# Altium schematic sheet 950V_Measure.SchDoc
size A2; Date: Date; CompanyName: HESSO; Engineer: Name; Address1: Route du Rawyl 47; Address2: 1950 Sion; Address3: Switzerland; ProjectName: Project Name
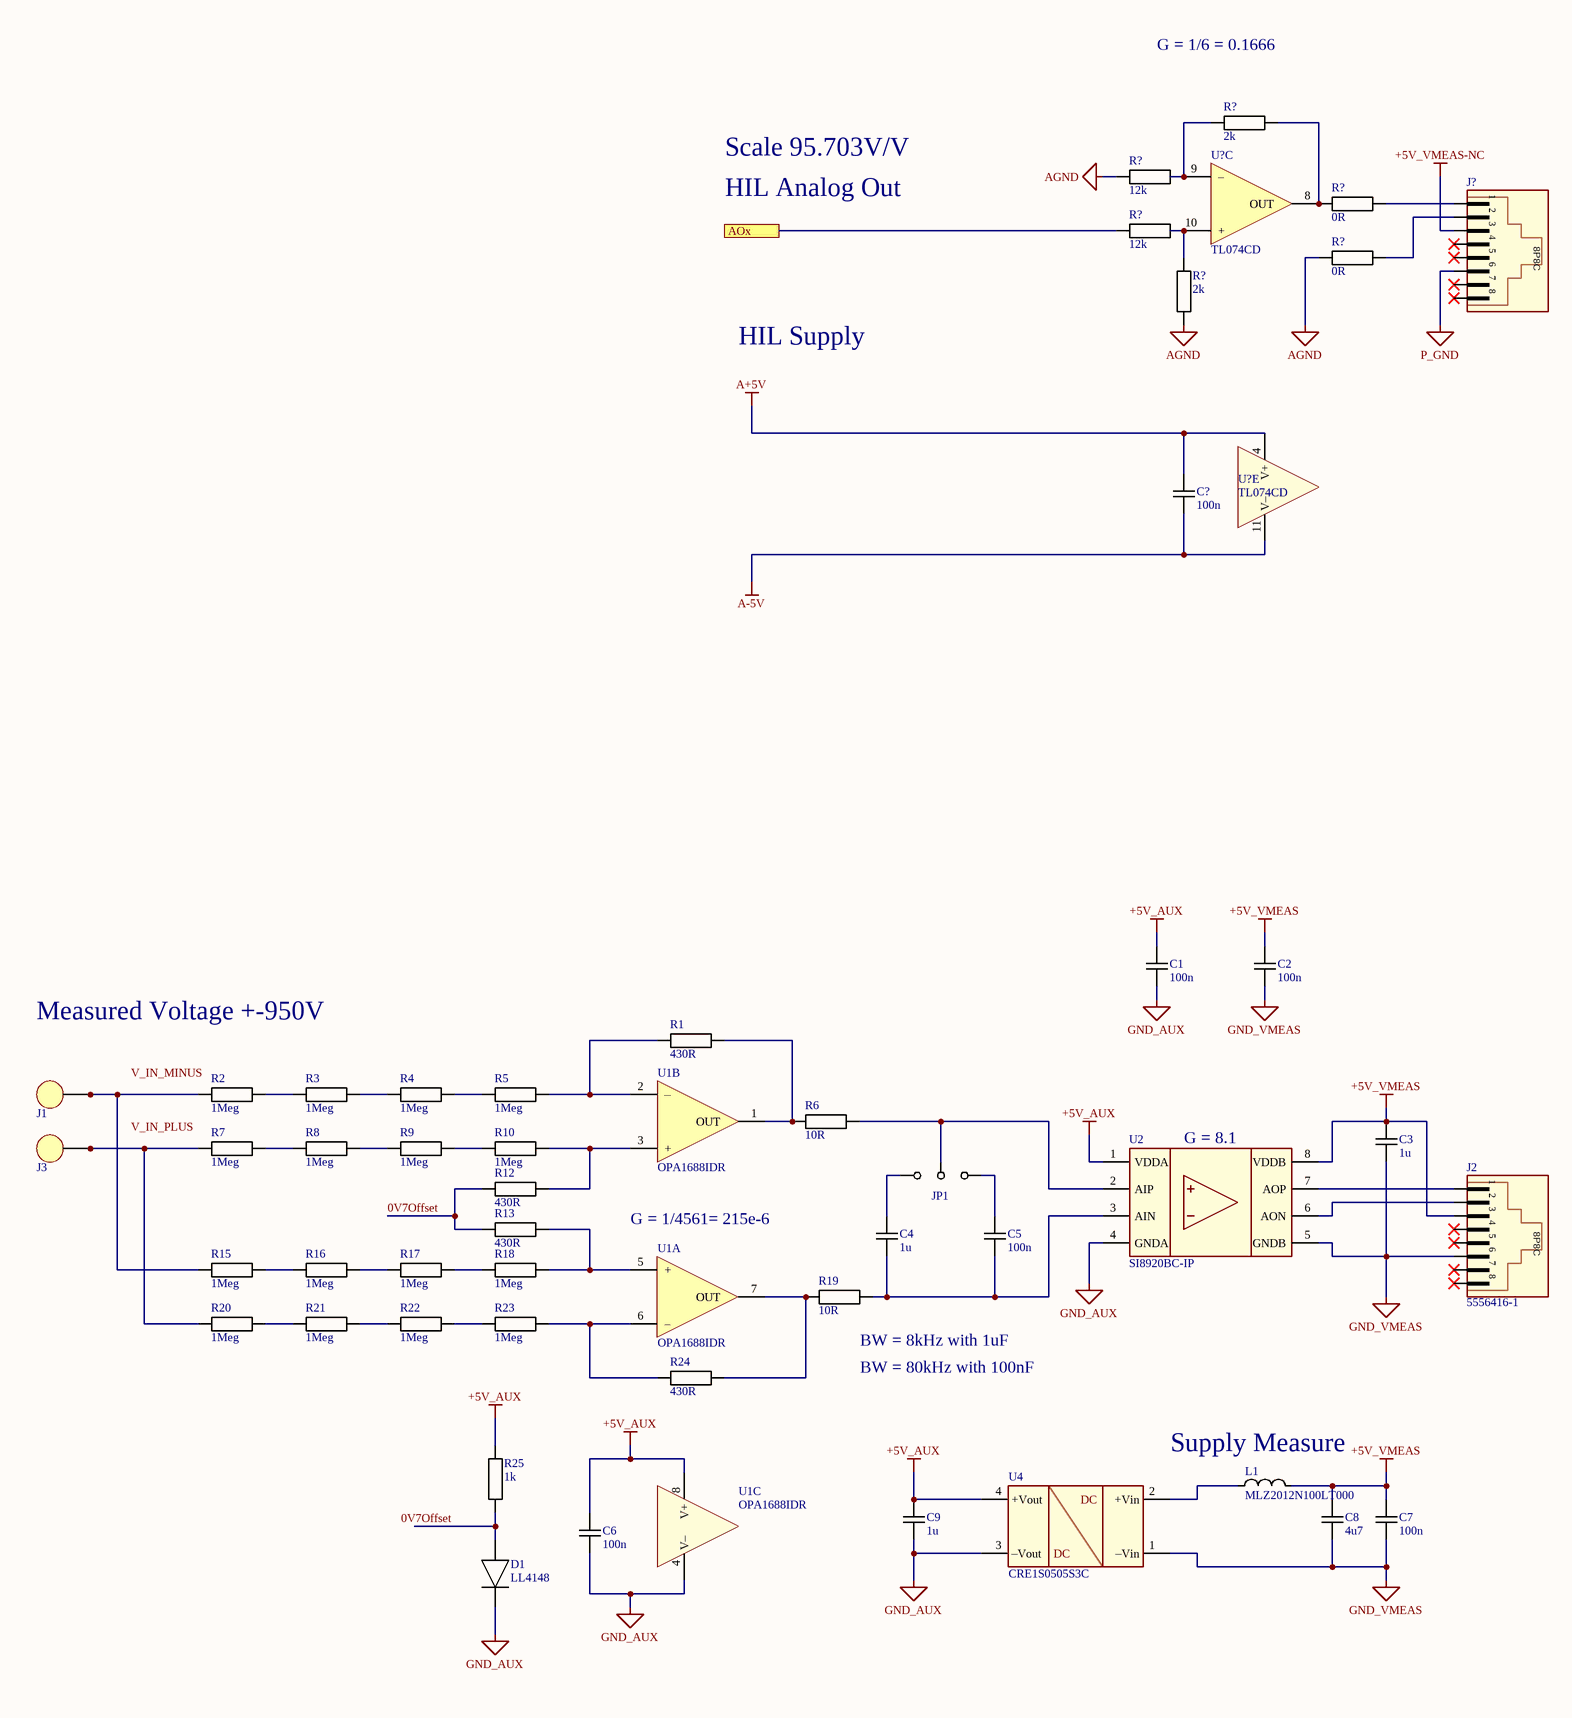
[diagram p0: 950V_Measure.SchDoc, left]
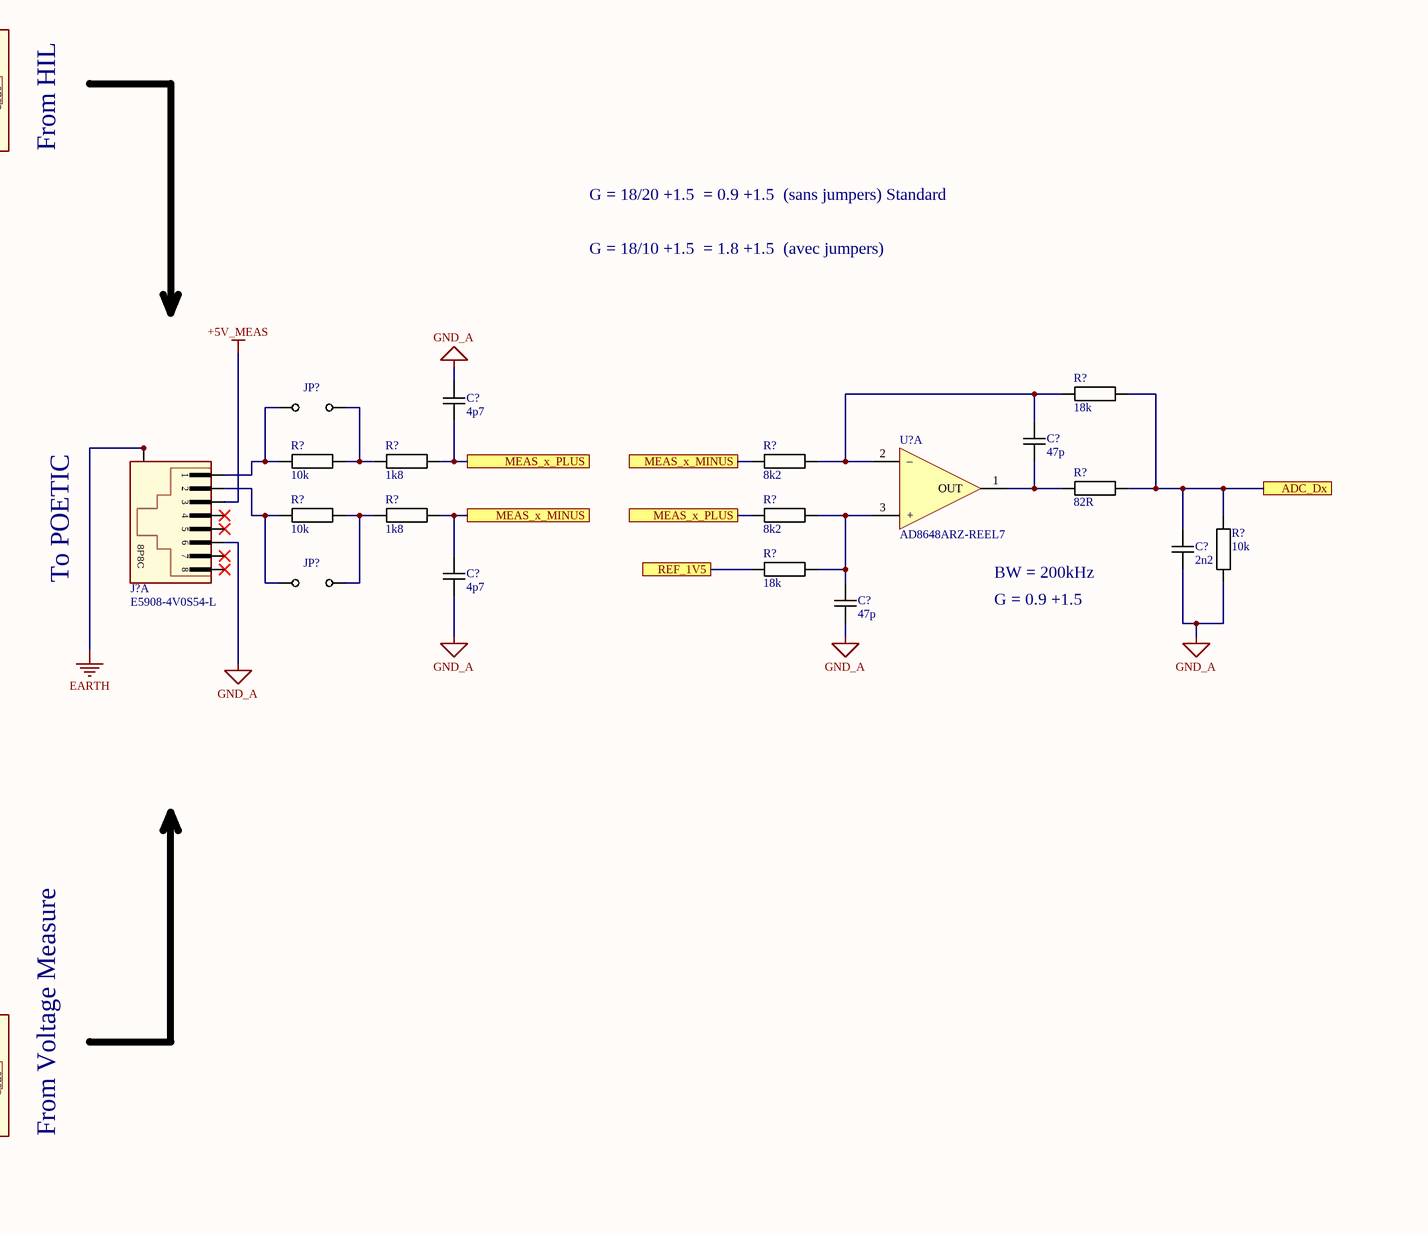
[diagram p1: 950V_Measure.SchDoc, right]

## Parts
(Parts that share a designator on the sheet are numbered #1, #2 ... from top to bottom, then left to right.)
C1  100n  [CAPACITOR 2012 REFLOW]
C2  100n  [CAPACITOR 2012 REFLOW]
C3  1u  [CAPACITOR 2012 REFLOW]
C4  1u  [CAPACITOR 2012 REFLOW]
C5  100n  [CAPACITOR 2012 REFLOW]
C6  100n  [CAPACITOR 2012 REFLOW]
C7  100n  [CAPACITOR 2012 REFLOW]
C8  4u7  [CAPACITOR 2012 REFLOW]
C9  1u  [CAPACITOR 2012 REFLOW]
C?#1  100n  [CAPACITOR 2012 REFLOW]
C?#2  4p7  [CAPACITOR 2012 REFLOW]
C?#3  47p  [CAPACITOR 1608 REFLOW]
C?#4  2n2  [CAPACITOR 1608 REFLOW]
C?#5  4p7  [CAPACITOR 2012 REFLOW]
C?#6  47p  [CAPACITOR 1608 REFLOW]
D1  LL4148  [DIODE MINI MELF DO213AA]
J1  7798  [SCREW TERMINAL M4]  (value not drawn)
J2  5556416-1  [RJ45 8P8C AMP 5556416-1]
J3  7798  [SCREW TERMINAL M4]  (value not drawn)
J?#1  RJ45 8P8C AMP 5556416-1  [RJ45 8P8C AMP 5556416-1]  (value not drawn)
J?#2  E5908-4V0S54-L  [RJ45 8P8C PULSE E5908-4V0S54-L]  (part A of 2)
JP1  {Value}  [JUMPER3 TH]  (value not drawn)  (net tie, no BOM)
JP?#1  890-18-036-10-803  [JUMPER2 TH]  (value not drawn)
JP?#2  890-18-036-10-803  [JUMPER2 TH]  (value not drawn)
L1  MLZ2012N100LT000  [INDUCTOR 2012 REFLOW]
R1  430R  [RESISTOR 2012 REFLOW]
R2  1Meg  [RESISTOR 2012 REFLOW]
R3  1Meg  [RESISTOR 2012 REFLOW]
R4  1Meg  [RESISTOR 2012 REFLOW]
R5  1Meg  [RESISTOR 2012 REFLOW]
R6  10R  [RESISTOR 2012 REFLOW]
R7  1Meg  [RESISTOR 2012 REFLOW]
R8  1Meg  [RESISTOR 2012 REFLOW]
R9  1Meg  [RESISTOR 2012 REFLOW]
R10  1Meg  [RESISTOR 2012 REFLOW]
R12  430R  [RESISTOR 2012 REFLOW]
R13  430R  [RESISTOR 2012 REFLOW]
R15  1Meg  [RESISTOR 2012 REFLOW]
R16  1Meg  [RESISTOR 2012 REFLOW]
R17  1Meg  [RESISTOR 2012 REFLOW]
R18  1Meg  [RESISTOR 2012 REFLOW]
R19  10R  [RESISTOR 2012 REFLOW]
R20  1Meg  [RESISTOR 2012 REFLOW]
R21  1Meg  [RESISTOR 2012 REFLOW]
R22  1Meg  [RESISTOR 2012 REFLOW]
R23  1Meg  [RESISTOR 2012 REFLOW]
R24  430R  [RESISTOR 2012 REFLOW]
R25  1k  [RESISTOR 2012 REFLOW]
R?#1  2k  [RESISTOR 2012 REFLOW]
R?#2  12k  [RESISTOR 2012 REFLOW]
R?#3  0R  [RESISTOR 2012 REFLOW]
R?#4  12k  [RESISTOR 2012 REFLOW]
R?#5  0R  [RESISTOR 2012 REFLOW]
R?#6  2k  [RESISTOR 2012 REFLOW]
R?#7  18k  [RESISTOR 1608 REFLOW]
R?#8  10k  [RESISTOR 2012 REFLOW]
R?#9  1k8  [RESISTOR 2012 REFLOW]
R?#10  8k2  [RESISTOR 1608 REFLOW]
R?#11  82R  [RESISTOR 1608 REFLOW]
R?#12  10k  [RESISTOR 2012 REFLOW]
R?#13  1k8  [RESISTOR 2012 REFLOW]
R?#14  8k2  [RESISTOR 1608 REFLOW]
R?#15  10k  [RESISTOR 1608 REFLOW]
R?#16  18k  [RESISTOR 1608 REFLOW]
U1  OPA1688IDR  [SO8 P1.27 C4.0X5.0 H1.75]  (parts A,B,C of 3)
U2  SI8920BC-IP  [LSOP8 P2.54 C6.4X9.6 H4.2]
U4  CRE1S0505S3C  [TRACO TME____S]
U?#1  TL074CD  [SO14 P1.27 C4.0X8.8 H1.75]  (part C of 5)
U?#2  TL074CD  [SO14 P1.27 C4.0X8.8 H1.75]  (part E of 5)
U?#3  AD8648ARZ-REEL7  [SO14 P1.27 C4.0X8.8 H1.75]  (part A of 5)

## Ports
ADC_Dx, AOx, MEAS_x_MINUS, MEAS_x_PLUS, REF_1V5

## Nets
+5V_AUX: C1.2 C6.2 C9.2 R25.2 U1.8(V+) U2.1(VDDA) U4.4(+Vout)
+5V_MEAS: J?#2.3A
+5V_VMEAS: C2.2 C3.1 C7.2 C8.2 J2.3 L1.1 U2.8(VDDB)
+5V_VMEAS-NC: J?#1.3
A+5V: C?#1.2 U?#2.4(V+)
A-5V: C?#1.1 U?#2.11(V–)
AGND: R?#2.1 R?#5.2 R?#6.1
EARTH: J?#2.9 J?#2.10 J?#2.11 J?#2.12(SHIELD)
GND_A: C?#2.2 C?#4.1 C?#5.1 C?#6.1 J?#2.6A R?#15.2
GND_AUX: C1.1 C6.1 C9.1 D1.1(C) U1.4(V–) U2.4(GNDA) U4.3(–Vout)
GND_VMEAS: C2.1 C3.2 C7.1 C8.1 J2.6 U2.5(GNDB) U4.1(–Vin)
P_GND: J?#1.6
0V7Offset: R12.2 R13.2
ADC_Dx: C?#4.2 R?#7.2 R?#11.2 R?#15.1 ; port ADC_Dx
AOx: R?#4.1 ; port AOx
MEAS_x_MINUS: C?#5.2 R?#10.1 R?#13.2 ; port MEAS_x_MINUS
MEAS_x_PLUS: C?#2.1 R?#9.2 R?#14.1 ; port MEAS_x_PLUS
REF_1V5: R?#16.2 ; port REF_1V5
NetC4_1: C4.1 C5.1 R19.1 U2.3(AIN)
NetC4_2: C4.2 JP1.3
NetC5_2: C5.2 JP1.1
NetC?#3_1: C?#3.1 R?#11.1 U?#3.1(OUT)
NetC?#3_2: C?#3.2 R?#7.1 R?#10.2 U?#3.2(–)
NetC?#6_2: C?#6.2 R?#14.2 R?#16.1 U?#3.3(+)
NetD1_2: D1.2(A) R25.1
NetJ1_1: J1.1(M4) J1.2 J1.3 J1.4 J1.5 J1.6 R2.2 R15.2
NetJ2_1: J2.1 U2.7(AOP)
NetJ2_2: J2.2 U2.6(AON)
NetJ3_1: J3.1(M4) J3.2 J3.3 J3.4 J3.5 J3.6 R7.2 R20.2
NetJ?#1_1: J?#1.1 R?#3.2
NetJ?#1_2: J?#1.2 R?#5.1
NetJ?#2_1A: J?#2.1A JP?#1.1 R?#8.1
NetJ?#2_2A: J?#2.2A JP?#2.1 R?#12.2
NetJP1_2: JP1.2 R6.1 U2.2(AIP)
NetJP?#1_2: JP?#1.2 R?#8.2 R?#9.1
NetJP?#2_2: JP?#2.2 R?#12.1 R?#13.1
NetL1_2: L1.2 U4.2(+Vin)
NetR1_1: R1.1 R6.2 U1.1(OUT)
NetR1_2: R1.2 R5.1 U1.2(–)
NetR2_1: R2.1 R3.2
NetR3_1: R3.1 R4.2
NetR4_1: R4.1 R5.2
NetR7_1: R7.1 R8.2
NetR8_1: R8.1 R9.2
NetR9_1: R9.1 R10.2
NetR10_1: R10.1 R12.1 U1.3(+)
NetR13_1: R13.1 R18.1 U1.5(+)
NetR15_1: R15.1 R16.2
NetR16_1: R16.1 R17.2
NetR17_1: R17.1 R18.2
NetR19_2: R19.2 R24.1 U1.7(OUT)
NetR20_1: R20.1 R21.2
NetR21_1: R21.1 R22.2
NetR22_1: R22.1 R23.2
NetR23_1: R23.1 R24.2 U1.6(–)
NetR?#1_1: R?#1.1 R?#2.2 U?#1.9(–)
NetR?#1_2: R?#1.2 R?#3.1 U?#1.8(OUT)
NetR?#4_2: R?#4.2 R?#6.2 U?#1.10(+)

Not connected (* = marked no-connect by the designer): J2 4* 5* 7* 8*; J?#1 4* 5* 7* 8*; J?#2 4A* 5A* 7A* 8A*

## Notes on the sheet
- G = 1/6 = 0.1666
- HIL Analog Out
- Scale 95.703V/V
- HIL Supply
- From HIL
- G = 18/20 +1.5  = 0.9 +1.5  (sans jumpers) Standard
- G = 18/10 +1.5  = 1.8 +1.5  (avec jumpers)
- To POETIC
- BW = 200kHz
- G = 0.9 +1.5
- Measured Voltage +-950V
- (near U2) G = 8.1
- (near U1) G = 1/4561= 215e-6
- From Voltage Measure
- (near R19) BW = 8kHz with 1uF
- BW = 80kHz with 100nF
- (near U4) Supply Measure
- Labels drawn without touching a wire or pin: 0V7Offset, V_IN_MINUS, V_IN_PLUS
- Date :
- Revision :
- Sheet
- of
- Design by :
- (in symbol RJ45 8P8C AMP 5556416-1) 8P8C
- (in symbol RJ45 8P8C PULSE E5908-4V0S54-L, part A) 1; 2; 3; 4; 5; 8P8C; 6; 7; 8
- (in symbol TRACO TME____S) DC

## Library data of the parts
C1 C2 C5-C7 = Capacitor: Capacitor X7R 10% 50V 2012(0805); Value: 100n
C3 C4 C8 C9 = Capacitor: Capacitor X7R 10% 10V 2012(0805)
  C3 C4 C9: Value: 1u
  C8: Value: 4u7
C?#1 = Capacitor: Value: *
C?#2 C?#5 = Capacitor: Capacitor X7R 50V 2012(0805); Value: 4p7
C?#3 C?#4 C?#6 = Capacitor: Capacitor X7R 10% 50V 1608(0603)
  C?#3 C?#6: Value: 47p
  C?#4: Value: 2n2
D1 = DIODE: Diode generic; Manufacturer: ON Semiconductor / Fairchild; Value: LL4148; Mouser No.: 512-LL4148
J1 J3 = SCREW TERMINAL M4: KEYSTONE PC METRIC SCREW TERMINAL; Manufacturer: Keystone Electronics; Mouser No.: 534-7798; Value: 7798
J2 = RJ45 8P8C AMP 5556416-1: Modular Jack Vertical Plastic 8P8C; Manufacturer: TE Connectivity; Value: 5556416-1; Mouser No.: 571-5556416-1
J?#1 = RJ45 8P8C AMP 5556416-1: Modular Jack Vertical Plastic 8P8C; Value: RJ45 8P8C AMP 5556416-1
J?#2 = RJ45 8P8C PULSE E5908-4V0S54-L: RJ45 2X1 8P8C Ethernet Connectors CONN 30u Au THT; Manufacturer: Pulse Electronics; Value: E5908-4V0S54-L; Mouser No.: 673-E5908-4V0S54-L
JP1 = JUMPER 3 POS: Value: {Value}
JP?#1 JP?#2 = JUMPER 2 POS: Manufacturer: PRECI-DIP; Value: 890-18-036-10-803; Distrelec No.: 143-83-920
L1 = Inductor: Manufacturer: TDK; Parameter 2: 810-MLZ2012N100LT000; Value: MLZ2012N100LT000
R1 R4-R6 R9 R10 R12 R13 R17-R19 R22-R25 = Resistor: Resistor 1% 100V 125mW 2012(0805)
  R1 R12 R13 R24: Value: 430R
  R4 R5 R9 R10 R17 R18 R22 R23: Value: 1Meg
  R6 R19: Value: 10R
  R25: Value: 1k
R2 R3 R7 R8 R15 R16 R20 R21 = Resistor: Resistor 1% 400V 125mW 2012(0805); Value: 1Meg
R?#1 R?#6 = Resistor: Value: 1.1k
R?#2 R?#4 = Resistor: Value: 6.8k
R?#3 R?#5 = Resistor: Value: 0R
R?#7 R?#10 R?#11 R?#14-R?#16 = Resistor: Resistor 1% 50V 100mW 1608(0603)
  R?#7 R?#16: Value: 18k
  R?#10 R?#14: Value: 8k2
  R?#11: Value: 82R
  R?#15: Value: 10k
R?#8 R?#9 R?#12 R?#13 = Resistor: Resistor 1% 50V 125mW 2012(0805)
  R?#8 R?#12: Value: 10k
  R?#9 R?#13: Value: 1k8
U1 = OPA DUAL: Generic dual OPA 8 pins; Manufacturer: Texas Instruments; Value: OPA1688IDR; Mouser No.: 595-OPA1688IDR
U2 = SI8920_C-IP: ISOLATED AMPLIFIER FOR CURRENT SHUNT MEASUREMENT; Manufacturer: Silicon Labs; Value: SI8920BC-IP; Mouser No.: 634-SI8920BC-IP
U4 = TRACO TME____S: TRACO DC/DC CONVERTER TME____S 1W; Manufacturer: Murata Power Solutions; Value: CRE1S0505S3C; Mouser No.: 580-CRE1S0505S3C
U?#1 U?#2 = OPA QUAD: Generic quad OPA 14 pins; Value: TL074CD
U?#3 = OPA QUAD: Generic quad OPA 14 pins; Manufacturer: Analog Devices; Value: AD8648ARZ-REEL7; Mouser No.: 584-AD8648ARZ-R7